# EAGLE board Spring2020V1.3 (EAGLE 9.5.2)
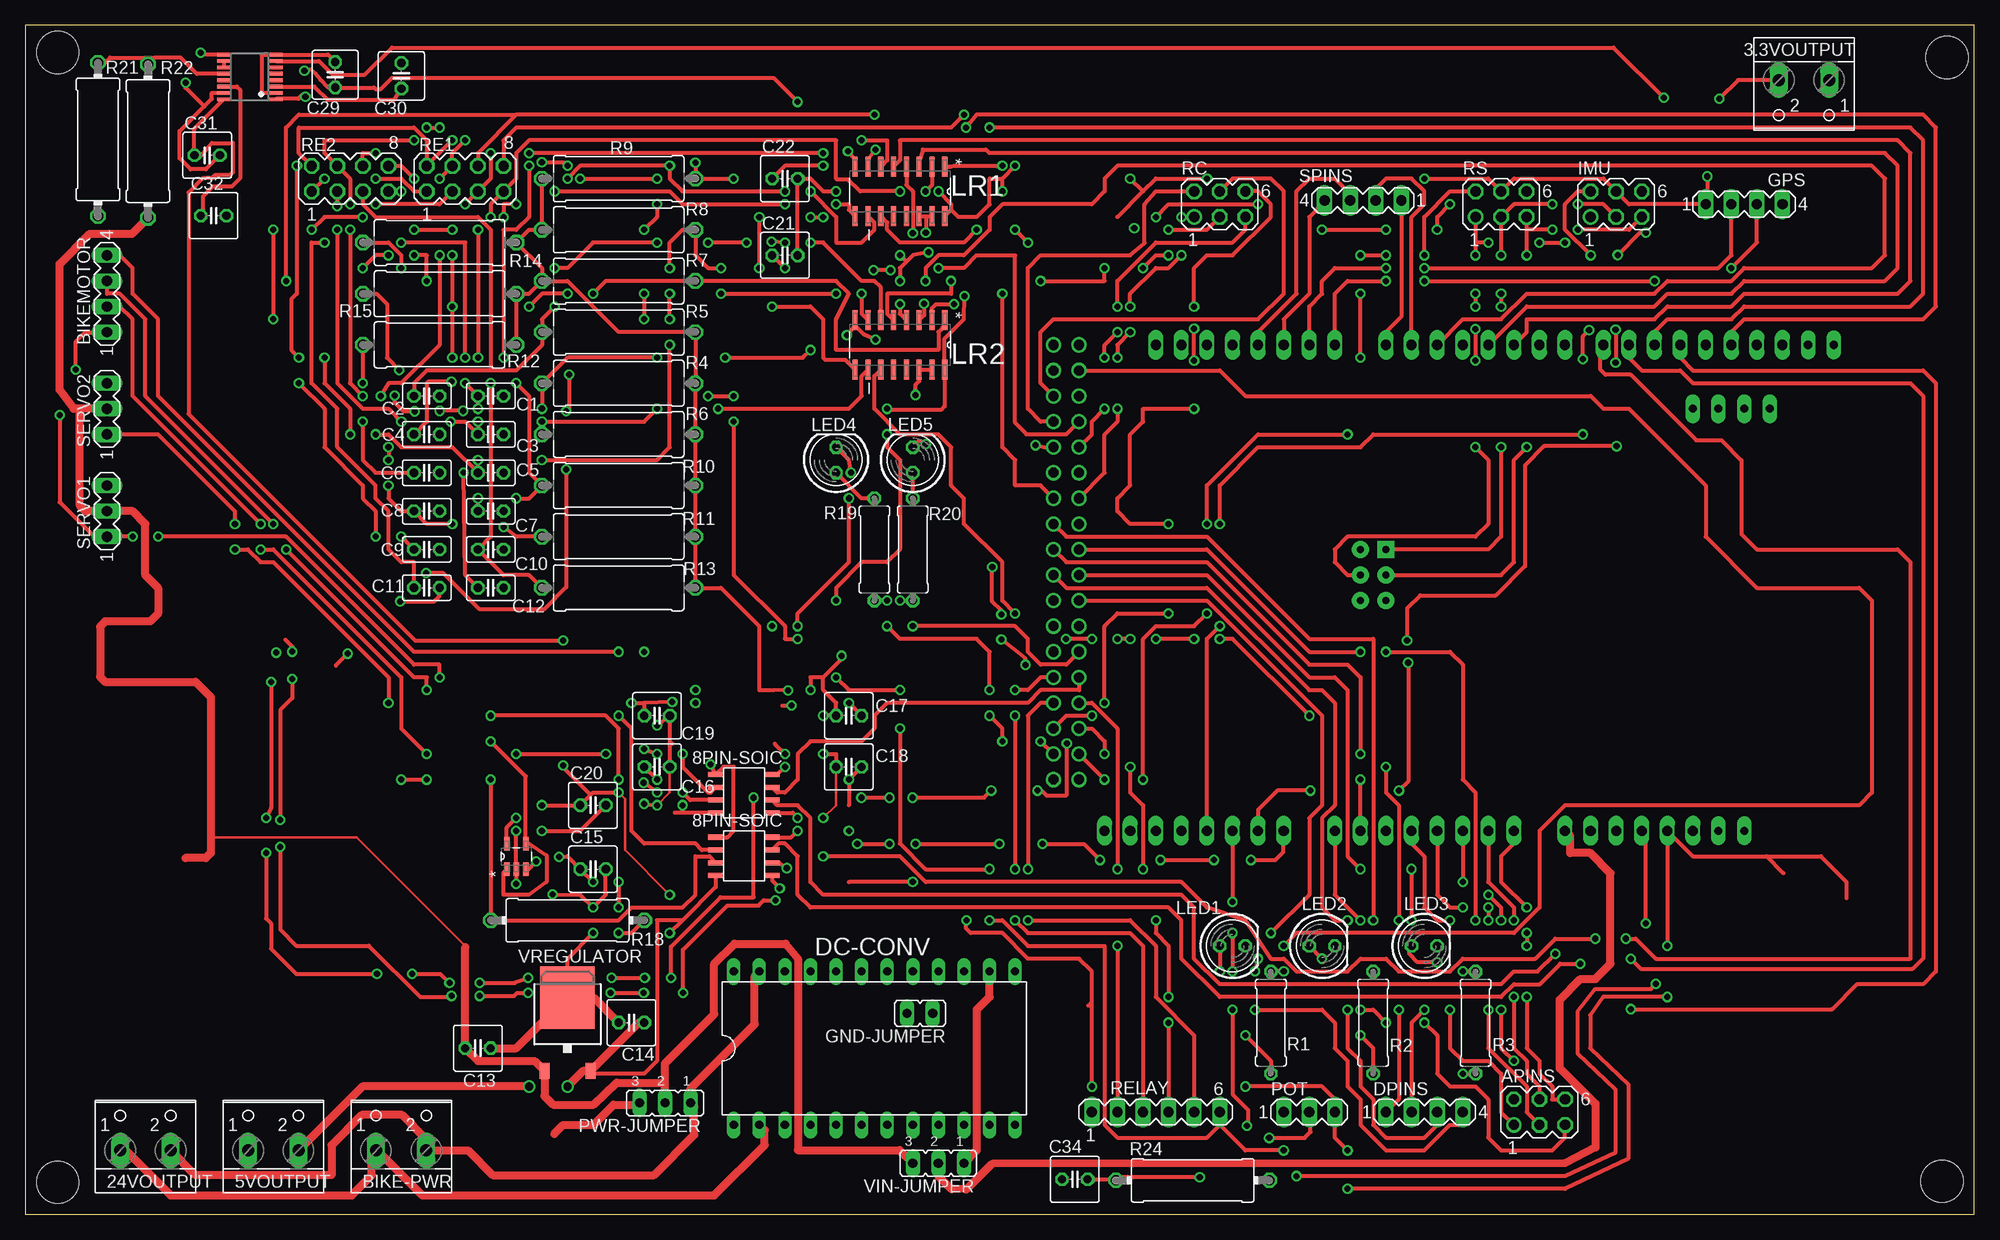
[diagram p2: board, top side]
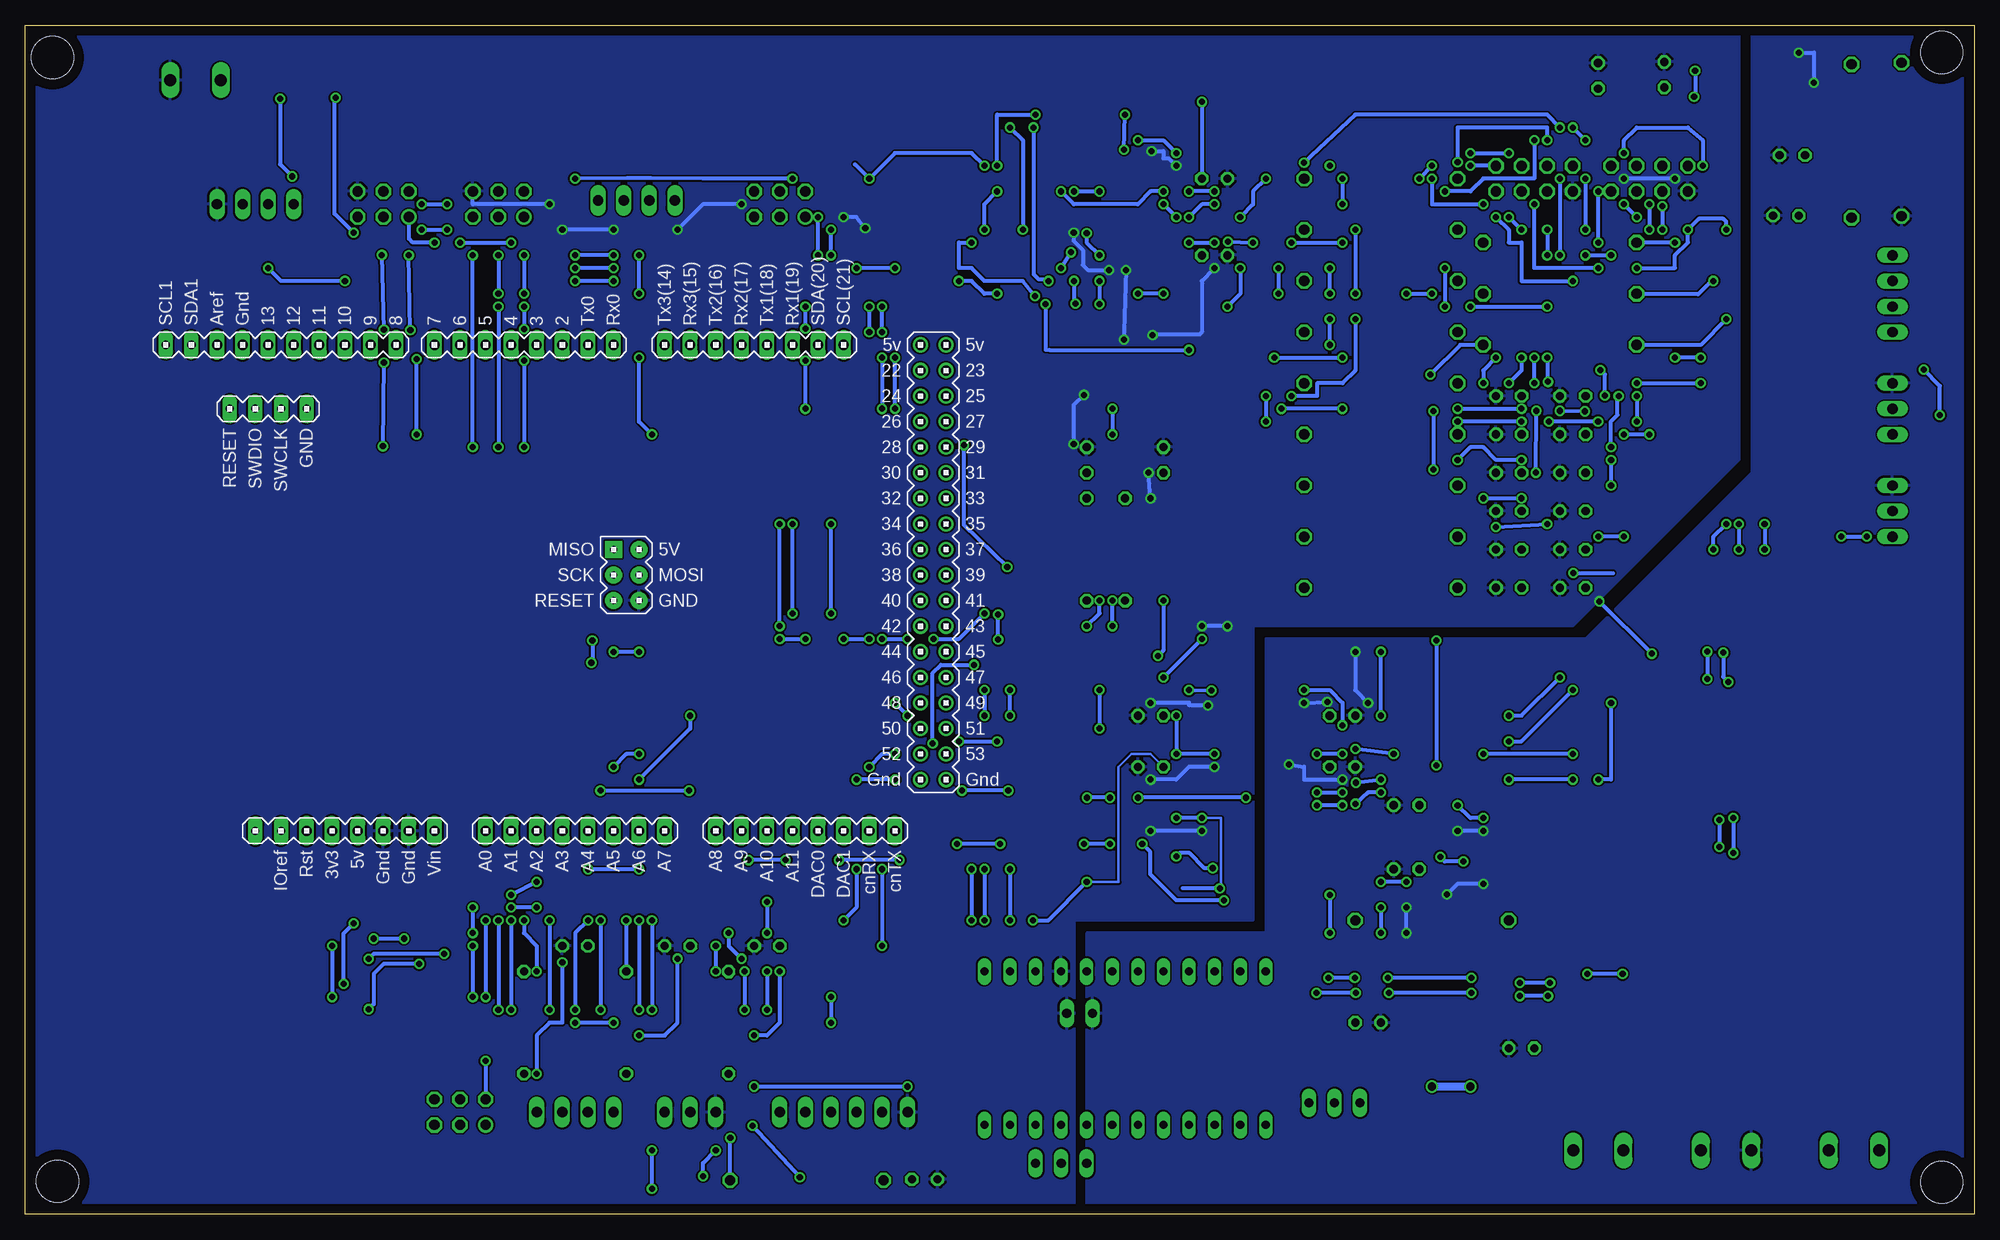
[diagram p3: board, bottom side, seen from below]

Size 193.55 x 118.11 mm. Coordinates in mm from the lower left corner, seen from the top.
Outline: 0,0 193.55,0 193.55,118.11 0,118.11 0,0
Copper layers (1*16): Top 0.035mm / dielectric 1.5mm / Bottom 0.035mm
Design rules "default *": minimum track width 10mil, minimum drill 0.6mm, track to track 7mil, track to pad 7mil, pad to pad 7mil, via to via 7mil, smd to smd 7mil, copper to edge 40mil, drill to drill 7mil, minimum pad ring 10mil, minimum via ring 8mil, stop-mask expansion 4mil, vias tented up to drill 0mil, thermal gap 10mil
Holes 4.2 mm at 3.23,3.19 3.23,115.39 190.83,114.89 190.33,3.29

## Footprints (pad centres in the part's own frame; a part is rotated, then mirrored left to right if it is on the bottom)
W237-102 = drill 1.194 long: 1 -2.5,-1.27; 2 2.5,-1.27
MA03-2 = drill 1.016: 1 -2.54,-1.27 | drill 1.016 octagon: 2 -2.54,1.27; 3 0,-1.27; 4 0,1.27; 5 2.54,-1.27; 6 2.54,1.27
MA04-1 = drill 1.016 long: 1 -3.81,0; 2 -1.27,0; 3 1.27,0; 4 3.81,0
C025-025X050 = drill 0.813 octagon: 1 -1.27,0; 2 1.27,0
C025-050X050 = drill 0.813 octagon: 1 -1.27,0; 2 1.27,0
DIL24-6 = drill 0.813 long: 1 -13.97,-7.62; 2 -11.43,-7.62; 3 -8.89,-7.62; 4 -6.35,-7.62; 5 -3.81,-7.62; 6 -1.27,-7.62; 7 1.27,-7.62; 8 3.81,-7.62; 9 6.35,-7.62; 10 8.89,-7.62; 11 11.43,-7.62; 12 13.97,-7.62; 13 13.97,7.62; 14 11.43,7.62; 15 8.89,7.62; 16 6.35,7.62; 17 3.81,7.62; 18 1.27,7.62; 19 -1.27,7.62; 20 -3.81,7.62; 21 -6.35,7.62; 22 -8.89,7.62; 23 -11.43,7.62; 24 -13.97,7.62
JP1 = drill 0.914 long: 1 0,-1.27; 2 0,1.27
LED5MM = drill 0.813 octagon: A -1.27,0; K 1.27,0
SOIC127P600X175-16N = smd 1.981 x 0.508: 1 -2.464,4.445; 2 -2.464,3.175; 3 -2.464,1.905; 4 -2.464,0.635; 5 -2.464,-0.635; 6 -2.464,-1.905; 7 -2.464,-3.175; 8 -2.464,-4.445; 9 2.464,-4.445; 10 2.464,-3.175; 11 2.464,-1.905; 12 2.464,-0.635; 13 2.464,0.635; 14 2.464,1.905; 15 2.464,3.175; 16 2.464,4.445
SOT95P280X145-5N = smd 1.321 x 0.559: 1 -1.27,0.94; 2 -1.27,0; 3 -1.27,-0.94; 4 1.27,-0.94; 5 1.27,0.94
MA03-1 = drill 1.016 long: 1 -2.54,0; 2 0,0; 3 2.54,0
JP2 = drill 0.914 long: 1 -2.54,0; 2 0,0; 3 2.54,0
0309/10 = drill 0.813 octagon: 1 -5.08,0; 2 5.08,0
P0613/15 = drill 1.016 octagon: 1 -7.62,0; 2 7.62,0
0414/15 = drill 1.016 octagon: 1 -7.62,0; 2 7.62,0
MA04-2 = drill 1.016 octagon: 1 -3.81,-1.27; 2 -3.81,1.27; 3 -1.27,-1.27; 4 -1.27,1.27; 5 1.27,-1.27; 6 1.27,1.27; 7 3.81,-1.27; 8 3.81,1.27
MA06-1 = drill 1.016 long: 1 -6.35,0; 2 -3.81,0; 3 -1.27,0; 4 1.27,0; 5 3.81,0; 6 6.35,0
DUE(NORMAL) = drill 1 long: 2 -16.51,30.48; 3 -19.05,30.48; 3V3 -39.37,-17.78; 4 -21.59,30.48; 5 -24.13,30.48; 5V -36.83,-17.78; 6 -26.67,30.48; 7 -29.21,30.48; 8 -33.02,30.48; 9 -35.56,30.48; 10 -38.1,30.48; 11 -40.64,30.48; 12 -43.18,30.48; 13 -45.72,30.48; A0 -24.13,-17.78; A1 -21.59,-17.78; A2 -19.05,-17.78; A3 -16.51,-17.78; A4 -13.97,-17.78; A5 -11.43,-17.78; A6 -8.89,-17.78; A7 -6.35,-17.78; A8 -1.27,-17.78; A9 1.27,-17.78; A10 3.81,-17.78; A11 6.35,-17.78; AREF -50.8,30.48; AREF1 -50.8,30.48; CANRX 13.97,-17.78; CANTX 16.51,-17.78; DAC0 8.89,-17.78; DAC1 11.43,-17.78; GND1 -48.26,30.48; GND_1 -34.29,-17.78; GND_2 -31.75,-17.78; RESET -41.91,-17.78; RX0 -11.43,30.48; RX1 6.35,30.48; RX2 1.27,30.48; RX3 -3.81,30.48; SCL 11.43,30.48; SDA 8.89,30.48; TX0 -13.97,30.48; TX1 3.81,30.48; TX2 -1.27,30.48; TX3 -6.35,30.48; VIN -29.21,-17.78 | drill 1: 5V_A 19.05,30.48; 5V_B 21.59,30.48; 22 19.05,27.94; 23 21.59,27.94; 24 19.05,25.4; 25 21.59,25.4; 26 19.05,22.86; 27 21.59,22.86; 28 19.05,20.32; 29 21.59,20.32; 30 19.05,17.78; 31 21.59,17.78; 32 19.05,15.24; 33 21.59,15.24; 34 19.05,12.7; 35 21.59,12.7; 36 19.05,10.16; 37 21.59,10.16; 38 19.05,7.62; 39 21.59,7.62; 40 19.05,5.08; 41 21.59,5.08; 42 19.05,2.54; 43 21.59,2.54; 44 19.05,0; 45 21.59,0; 46 19.05,-2.54; 47 21.59,-2.54; 48 19.05,-5.08; 49 21.59,-5.08; 50 19.05,-7.62; 51 21.59,-7.62; 52 19.05,-10.16; 53 21.59,-10.16; GND_A 19.05,-12.7; GND_B 21.59,-12.7 | drill 0.7 pad 1.676: 5V_ICSP -8.89,5.08; GND_ICSP -8.89,10.16; MOSI_ICSP -8.89,7.62; RESET_ICSP -11.43,5.08; SCK_ICSP -11.43,7.62 | drill 0.8 pad 1.422 long: GND_DEBUG -41.91,24.13; IOREF -44.45,-17.78; NC -46.99,-17.78; RESET_DEBUG -49.53,24.13; SCL1 -55.88,30.48; SDA1 -53.34,30.48; SWCLK_DEBUG -44.45,24.13; SWDIO_DEBUG -46.99,24.13 | drill 0.7 pad 1.676 square: MISO_ICSP -11.43,10.16
8PINSOIC = smd 1.524 x 0.508: 1 -2.794,2.286; 2 -2.794,1.016; 3 -2.794,-0.254; 4 -2.794,-1.524; 5 2.794,-1.524; 6 2.794,-0.254; 7 2.794,1.016; 8 2.794,2.286
QSOP16 = smd 0.381 x 1.27: 1 -2.223,-2.6; 2 -1.587,-2.6; 3 -0.953,-2.6; 4 -0.318,-2.6; 5 0.318,-2.6; 6 0.953,-2.6; 7 1.587,-2.6; 8 2.223,-2.6; 9 2.223,2.6; 10 1.587,2.6; 11 0.953,2.6; 12 0.318,2.6; 13 -0.318,2.6; 14 -0.953,2.6; 15 -1.587,2.6; 16 -2.223,2.6
TO252 = smd 1 x 1.6: 1 -2.28,-4.8; 2 2.28,-4.8 | smd 5.4 x 6.2: 3 0,2.5

## Placement (x,y rotation side)
3.3VOUTPUT  [W237-102]  176.63,111.39 180 top
5VOUTPUT  [W237-102]  24.64,7.62 0 top
24VOUTPUT  [W237-102]  11.94,7.62 0 top
APINS  [MA03-2]  150.37,10.16 0 top
BIKE-PWR  [W237-102]  37.34,7.62 0 top
BIKEMOTOR  [MA04-1]  8.13,91.44 90 top
C1  [C025-025X050]  46.23,81.28 0 top
C2  [C025-025X050]  39.88,81.28 0 top
C3  [C025-025X050]  46.23,77.47 0 top
C4  [C025-025X050]  39.88,77.47 0 top
C5  [C025-025X050]  46.23,73.66 0 top
C6  [C025-025X050]  39.88,73.66 0 top
C7  [C025-025X050]  46.23,69.85 0 top
C8  [C025-025X050]  39.88,69.85 0 top
C9  [C025-025X050]  39.88,66.04 0 top
C10  [C025-025X050]  46.23,66.04 0 top
C11  [C025-025X050]  39.88,62.23 0 top
C12  [C025-025X050]  46.23,62.23 0 top
C13  [C025-050X050]  44.96,16.51 0 top
C14  [C025-050X050]  60.2,19.05 180 top
C15  [C025-050X050]  56.39,34.29 0 top
C16  [C025-050X050]  62.74,44.45 180 top
C17  [C025-050X050]  81.79,49.53 0 top
C18  [C025-050X050]  81.79,44.45 0 top
C19  [C025-050X050]  62.74,49.53 180 top
C20  [C025-050X050]  56.39,40.64 0 top
C21  [C025-050X050]  75.44,95.25 0 top
C22  [C025-050X050]  75.44,102.87 0 top
C29  [C025-050X050]  30.79,113.19 90 top
C30  [C025-050X050]  37.36,113.08 90 top
C31  [C025-050X050]  18.08,105.19 0 top
C32  [C025-050X050]  18.71,99.19 0 top
C34  [C025-050X050]  104.23,3.49 180 top
DC-CONV  [DIL24-6]  84.33,16.51 0 top
DPINS  [MA04-1]  138.94,10.16 0 top
GND-JUMPER  [JP1]  88.85,19.97 90 top
GPS  [MA04-1]  170.69,100.33 0 top
IMU  [MA03-2]  157.99,100.33 0 top
LED1  [LED5MM]  119.89,26.67 0 top
LED2  [LED5MM]  128.78,26.67 0 top
LED3  [LED5MM]  138.94,26.67 0 top
LED4  [LED5MM]  80.52,74.93 90 top
LED5  [LED5MM]  88.14,74.93 90 top
LR1  ST26C32ABDR  [SOIC127P600X175-16N]  86.87,101.6 270 top
LR2  ST26C32ABDR  [SOIC127P600X175-16N]  86.87,86.36 270 top
OP-AMP  OPAMP  [SOT95P280X145-5N]  48.77,35.56 90 top
POT  [MA03-1]  127.51,10.16 0 top
PWR-JUMPER  [JP2]  63.54,11.08 180 top
R1  [0309/10]  123.7,19.05 270 top
R2  [0309/10]  133.86,19.05 270 top
R3  [0309/10]  144.02,19.05 270 top
R4  [P0613/15]  58.93,82.55 0 top
R5  [P0613/15]  58.93,87.63 0 top
R6  [P0613/15]  58.93,77.47 0 top
R7  [P0613/15]  58.93,92.71 0 top
R8  [P0613/15]  58.93,97.79 0 top
R9  [P0613/15]  58.93,102.87 0 top
R10  [P0613/15]  58.93,72.39 180 top
R11  [P0613/15]  58.93,67.31 180 top
R12  [P0613/15]  41.15,86.36 180 top
R13  [P0613/15]  58.93,62.23 180 top
R14  [P0613/15]  41.15,96.52 180 top
R15  [P0613/15]  41.15,91.44 180 top
R18  [0414/15]  53.85,29.21 0 top
R19  [0309/10]  84.33,66.04 90 top
R20  [0309/10]  88.14,66.04 90 top
R21  [0414/15]  7.23,106.76 90 top
R22  [0414/15]  12.2,106.6 270 top
R24  [0414/15]  115.93,3.39 180 top
RC  [MA03-2]  118.62,100.33 0 top
RE1  [MA04-2]  43.69,102.87 0 top
RE2  [MA04-2]  32.26,102.87 0 top
RELAY  [MA06-1]  112.27,10.16 0 top
RS  [MA03-2]  146.56,100.33 0 top
SERVO1  [MA03-1]  8.13,69.85 90 top
SERVO2  [MA03-1]  8.13,80.01 90 top
SPINS  [MA04-1]  132.84,100.71 180 top
U$1  DUE(NORMAL)  [DUE(NORMAL)]  123.7,55.88 0 bottom
U$2  IL-711  [8PINSOIC]  71.37,42.16 180 top
U$5  ISOLATED_ERROR_AMP_ADUM3190  [QSOP16]  22.32,112.96 90 top
U$7  IL-712  [8PINSOIC]  71.37,35.94 180 top
VIN-JUMPER  [JP2]  90.68,5.08 180 top
VREGULATOR  7818DT  [TO252]  53.85,19.05 0 top

## Tracks (layer width: path | path; a pad name or v marks a point on that pad's centre or on a via)
1AIN1  (via drill 0.6)
  Top 0.406: LR1.1 91.87,104.06 92.25,104.14 v97.03,104.14 | v93.22,109.22 91.95,107.95 48.77,107.95 47.5,106.68 RE1.8 | v50.04,104.14 50.04,99.06 48.77,97.79 47.5,97.79 v47.5,85.09 | v48.77,82.55 50.04,81.28 50.04,73.66 R10.2 50.04,71.12 v48.77,71.12 | C7.1 v44.96,71.12
  Bottom 0.406: v97.03,104.14 97.03,109.22 v93.22,109.22 | RE1.8 v50.04,104.14 | v47.5,85.09 48.77,83.82 v48.77,82.55 | v44.96,71.12 v48.77,71.12
1AIN2  (via drill 0.6)
  Top 0.406: LR1.2 90.04,102.23 v89.41,101.6 | v86.87,101.6 82.92,101.6 81.73,102.79 80.6,102.79 80.52,102.87 80.52,106.68 50.04,106.68 48.77,105.41 48.77,102.87 RE1.7 46.23,100.33 v46.23,99.06 | v44.96,97.79 v44.96,85.09 | v46.23,82.55 46.23,67.31 C10.1 47.5,63.5 50.04,63.5 R13.2
  Bottom 0.406: v89.41,101.6 v86.87,101.6 | v46.23,99.06 v44.96,97.79 | v44.96,85.09 44.96,83.82 v46.23,82.55
1AOUT
  Top 0.406: U$1.4 149.1,90.17 161.8,90.17 163.07,91.44 169.42,91.44 170.69,92.71 184.66,92.71 185.93,93.98 185.93,104.14 184.66,105.41 95.76,105.41 95.41,105.76 89.14,105.76 88.79,104.7 LR1.3
1BIN1  (via drill 0.6)
  Top 0.406: LR1.7 83.69,104.78 v84.43,105.76 | v84.33,109.22 48.77,109.22 | 48.77,109.22 44.96,105.41 RE1.6 | v25.91,92.71 25.91,107.95 27.18,109.22 48.77,109.22 | C12.1 43.69,63.5 v43.54,73.66 | v43.49,79.81 v41.15,79.81 | v36.69,81.33 36.69,80.63 37.53,79.79 38.63,79.79 v38.66,79.76 | R15.2 34.88,91.44 35.93,90.39 35.93,85.08 v37.14,83.87
  Bottom 0.406: v84.43,105.76 v84.33,109.22 | v43.54,73.66 v43.49,79.81 | v41.15,79.81 v38.66,79.76 | v25.91,92.71 26.11,92.71 27.43,91.39 33.48,91.39 R15.2 | v36.69,81.33 36.69,83.42 v37.14,83.87
1BIN2  (via drill 0.6)
  Top 0.406: v79.25,105.41 v50.04,105.41 | v46.23,105.41 46.23,102.87 RE1.5 v43.69,100.33 | v83.06,106.68 85.6,106.68 85.6,104.7 LR1.6 | C11.1 38.61,64.77 37.34,64.77 36.07,66.04 36.07,69.85 34.8,71.12 34.8,72.39 30.99,76.2 30.99,80.01 28.45,82.55 28.45,96.52 v29.72,96.52 | R14.2 36.07,96.52 37.34,95.25 v37.34,93.98
  Bottom 0.406: v83.06,106.68 80.52,106.68 v79.25,105.41 | v50.04,105.41 v46.23,105.41 | v29.72,96.52 R14.2 | v37.34,93.98 43.69,93.98 v43.69,100.33
1BOUT
  Top 0.406: U$1.5 149.1,87.63 149.1,88.9 161.8,88.9 163.07,90.17 169.42,90.17 170.69,91.44 185.93,91.44 187.2,92.71 187.2,105.41 185.93,106.68 86.87,106.68 86.87,104.7 LR1.5
1CIN1  (via drill 0.6)
  Top 0.406: v41.15,102.87 RE1.4 42.42,105.41 v43.69,106.68 | v41.15,95.25 41.15,86.36 37.34,82.55 36.07,82.55 v35.32,81.28 | v36.07,76.2 v36.07,74.93 | v36.07,72.39 36.07,71.12 37.34,69.85 C8.1 39.88,68.58 v42.42,68.58 | v52.58,101.6 64.01,101.6 65.28,100.33 v75.44,100.33 | v77.98,99.06 v79.25,99.06 | v80.52,100.33 81.79,100.33 81.79,99.77 LR1.9 | R11.2 48.77,67.31 v47.5,68.28
  Bottom 0.406: v41.15,102.87 v41.15,95.25 | v36.07,74.93 v36.07,72.39 | v43.69,106.68 43.69,102.87 48.77,102.87 50.04,101.6 v52.58,101.6 | v75.44,100.33 76.71,100.33 v77.98,99.06 | v79.25,99.06 v80.52,100.33 | v47.5,68.28 v42.42,68.58 | v36.07,76.2 36.07,78.75 35.43,79.39 35.43,81.17 v35.32,81.28
1CIN2  (via drill 0.6)
  Top 0.406: RE1.3 41.15,100.33 v34.8,100.33 | v33.53,99.06 29.72,99.06 v28.45,97.79 | v24.64,97.79 v24.64,88.9 | v75.44,101.6 65.28,101.6 64.01,102.87 v64.01,104.14 55.12,104.14 v53.85,102.87 | v77.98,101.6 80.52,99.06 80.52,96.52 83.06,96.52 84.33,97.79 84.33,98.5 LR1.10 | v48.77,100.33 47.5,100.33 v47.5,99.06 | v39.88,92.71 39.88,95.25 v38.61,95.25 | v36.07,95.25 34.8,95.25 v33.53,93.98 | R12.2 v33.53,82.55 | v27.18,82.55 29.72,80.01 29.72,76.2 33.53,72.39 33.53,71.12 34.8,69.85 v34.8,67.31 | v37.34,67.31 C9.1
  Bottom 0.406: v34.8,100.33 v33.53,99.06 | v24.64,88.9 27.18,86.36 R12.2 | v75.44,101.6 v77.98,101.6 | v53.85,102.87 53.85,100.33 v48.77,100.33 | v47.5,99.06 46.23,97.79 46.23,96.52 44.96,96.52 44.96,92.71 v39.88,92.71 | v38.61,95.25 v36.07,95.25 | v33.53,93.98 29.72,93.98 29.72,95.25 28.45,96.52 v28.45,97.79 27.35,98.89 24.93,98.89 24.64,98.6 v24.64,97.79 | v33.53,82.55 v27.18,82.55 | v34.8,67.31 v37.34,67.31
1COUT  (via drill 0.6)
  Top 0.406: U$1.10 161.8,87.63 163.07,88.9 169.42,88.9 170.69,90.17 187.2,90.17 188.47,91.44 188.47,106.68 187.2,107.95 v95.76,107.95 | v94.49,97.79 93.22,96.52 86.87,96.52 85.6,97.79 85.6,98.5 LR1.11
  Bottom 0.406: v95.76,107.95 94.49,106.68 v94.49,97.79
2AIN1  (via drill 0.6)
  Top 0.406: LR2.1 91.31,88.27 90.68,87.63 90.68,85.86 80.52,85.86 80.52,88.9 81.79,91.44 80.52,92.71 R7.2 57.66,92.71 v56.39,91.44 | v53.85,91.44 51.31,91.44 v50.04,90.17 | v42.42,85.09 v42.42,90.17 v42.42,95.25 | C4.1 39.88,78.74 39.88,82.55 40.02,82.69 v42.33,82.69 | RE2.8 37.34,104.14 v38.61,102.87 | v38.61,97.79 v42.42,97.79
  Bottom 0.406: v56.39,91.44 v53.85,91.44 | v50.04,90.17 v42.42,90.17 | v38.61,102.87 v38.61,97.79 | v42.42,97.79 v42.42,95.25 | v42.42,85.09 42.42,82.78 v42.33,82.69
2AIN2  (via drill 0.6)
  Top 0.406: v43.69,82.55 C1.1 v44.96,80.01 | v43.69,85.09 43.69,96.52 v37.34,96.52 | v37.34,101.6 RE2.7 | v62.74,85.09 53.85,85.09 R4.1 v51.31,80.01 | LR2.2 90.04,90 90.43,90.39 v92.23,90.39 | v69.52,85.09 77.21,85.09 v77.98,85.86
  Bottom 0.406: v43.69,82.55 v43.69,85.09 | v37.34,96.52 v37.34,101.6 | v77.98,85.86 91.85,85.86 92.23,85.88 v92.23,90.39 | v69.52,85.09 v62.74,85.09 | v51.31,80.01 v44.96,80.01
2AOUT  (via drill 0.6)
  Top 0.406: U$1.2 142.75,88.9 146.56,88.9 149.1,91.44 161.8,91.44 163.07,92.71 169.42,92.71 170.69,93.98 183.39,93.98 184.66,95.25 184.66,102.87 183.39,104.14 108.46,104.14 107.19,102.87 107.19,101.6 105.92,100.33 97.03,100.33 95.76,99.06 95.76,97.79 93.22,95.25 90.68,95.25 89.41,93.98 v89.41,92.71 | v89.26,90.47 89.26,89.31 LR2.3
  Bottom 0.406: v89.41,92.71 89.41,90.62 v89.26,90.47
2BIN1  (via drill 0.6)
  Top 0.406: RE2.6 33.53,105.41 v34.8,105.41 | v29.72,85.09 29.72,82.55 32.26,80.01 v32.26,77.47 | v34.8,77.47 36.07,77.47 37.34,76.2 42.42,76.2 C5.1 v44.96,74.93 | v51.31,74.93 62.74,74.93 64.01,76.2 v64.01,86.36 | v64.01,88.9 v64.01,91.44 | v64.01,93.98 64.01,96.52 65.28,97.79 R8.2 66.55,95.25 67.82,93.98 v69.09,93.98 | v69.09,91.44 v80.52,91.44 | v83.06,91.44 83.06,89.46 LR2.7 | v26.98,104.14 26.98,91.44 26.43,90.89 26.43,85.84 v27.18,85.09
  Bottom 0.406: v34.8,105.41 34.8,106.68 33.53,107.95 28.45,107.95 26.98,106.68 v26.98,104.14 | v27.18,85.09 v29.72,85.09 | v32.26,77.47 v34.8,77.47 | v44.96,74.93 47.5,74.93 48.77,76.2 50.04,76.2 v51.31,74.93 | v64.01,86.36 v64.01,88.9 | v64.01,91.44 v64.01,93.98 | v69.09,93.98 v69.09,91.44 | v80.52,91.44 v83.06,91.44
2BIN2  (via drill 0.6)
  Top 0.406: 46.23,83.82 48.77,83.82 51.31,86.36 R5.1 51.31,88.9 v52.58,90.17 | 46.23,83.82 39.88,83.82 38.61,82.55 C2.1 | RE2.5 33.53,100.33 34.8,99.06 44.96,99.06 46.23,97.79 46.23,83.82 | LR2.6 84.96,92.08 84.33,92.71 83.06,92.71 79.25,96.52 v77.98,96.52 | v75.44,96.52 v74.12,96.62 | v71.63,96.52 v67.82,96.52 | v62.74,96.52 56.39,96.52 53.85,93.98 v52.58,93.98
  Bottom 0.406: v77.98,96.52 v75.44,96.52 | v74.12,96.62 v71.63,96.52 | v67.82,96.52 v62.74,96.52 | v52.58,93.98 v52.58,90.17
2BOUT  (via drill 0.6)
  Top 0.406: U$1.13 169.42,87.63 170.69,88.9 188.47,88.9 189.74,90.17 189.74,107.95 188.47,109.22 94.49,109.22 v93.42,107.95 | v91.92,92.71 91.95,91.44 85.6,91.44 85.6,89.46 LR2.5
  Bottom 0.406: v93.42,107.95 93.42,93.38 92.93,92.89 92.1,92.89 v91.92,92.71
2CIN1  (via drill 0.6)
  Top 0.406: v38.61,106.68 29.72,106.68 29.72,105.41 RE2.4 32.26,102.87 v32.26,100.33 | v32.26,97.79 32.26,82.55 v33.53,81.28 | v33.53,78.74 33.53,74.93 34.8,73.66 C6.1 | v39.88,107.95 v41.15,107.95 | v66.55,104.44 R9.2 v70.36,102.87 | v72.9,99.06 v72.9,93.98 | v74.17,90.17 77.98,90.17 79.25,88.9 79.25,85.07 79.43,84.89 81.43,84.89 LR2.9
  Bottom 0.406: v38.61,106.68 v39.88,107.95 | v32.26,100.33 v32.26,97.79 | v33.53,81.28 v33.53,78.74 | v41.15,107.95 42.42,109.22 61.47,109.22 v66.55,104.44 | v70.36,102.87 71.63,101.6 71.63,100.33 v72.9,99.06 | v72.9,93.98 72.9,91.44 v74.17,90.17
2CIN2  (via drill 0.6)
  Top 0.406: RE2.3 v30.99,100.13 | v30.99,97.79 30.99,82.55 33.53,80.01 36.07,80.01 37.34,78.74 v37.36,78.74 | v42.25,78.74 43.69,78.74 C3.1 v44.96,78.74 | R6.1 v51.31,78.74 61.47,78.74 v62.74,80.01 | v68.82,80.01 81.79,80.01 83.06,81.28 83.06,83.26 LR2.10
  Bottom 0.406: v30.99,100.13 v30.99,97.79 | v37.36,78.74 v42.25,78.74 | v62.74,80.01 v68.82,80.01 | v44.96,78.74 v51.31,78.74
2COUT  (via drill 0.6)
  Top 0.406: U$1.A6 v132.59,43.18 | v127.51,49.53 119.89,57.15 v118.62,57.15 | v116.08,57.15 v112.27,57.15 | v109.73,57.15 v108.46,57.15 | v105.92,57.15 v103.36,57.15 | v98.3,59.69 97.03,60.96 97.03,64.77 93.22,68.58 93.22,71.12 91.95,72.39 91.95,76.2 90.68,77.47 86.87,77.47 84.33,80.01 84.33,83.26 LR2.11
  Bottom 0.406: v118.62,57.15 v116.08,57.15 | v112.27,57.15 v109.73,57.15 | v108.46,57.15 v105.92,57.15 | v103.36,57.15 100.84,57.15 v98.3,59.69 | v127.51,49.53 127.51,48.26 v132.59,43.18
3.3V  (via drill 0.6)
  Top 0.254: v79.25,39.37 80.52,40.64 C18.1 | 74.3,52.07 74.04,52.07
  Top 0.406: 172.93,35.56 165.61,35.56 U$1.3V3 v163.07,26.67 | 172.93,35.56 178.31,35.56 180.85,33.02 180.85,31.43 | v163.07,21.59 156.68,21.59 155.41,19.82 155.41,16.51 159.17,12.9 159.17,5.55 152.91,2.54 v131.32,2.54 | v131.32,6.35 130.05,7.62 POT.3 130.05,11.43 128.78,12.7 v121.16,12.7 | 108.46,99.06 111,101.6 | 111,101.6 112.27,102.87 v117.37,102.87 | v138.94,102.87 145.29,102.87 RS.4 147.83,102.87 156.72,102.87 IMU.4 159.26,100.33 GPS.1 167.03,100.48 v167.03,103.09 | v85.6,77.47 85.6,76.2 86.87,74.93 86.87,66.04 85.6,64.77 83.06,64.77 80.52,62.23 v80.52,60.96 | v77.98,52.07 77.98,53.34 79.25,53.34 | v75.74,52.02 74.3,52.07 | 79.25,53.34 79.25,52.07 80.52,50.8 C17.1 v79.25,49.53 | v79.25,45.72 80.52,45.72 C18.1 | U$2.1 76.2,39.88 v76.71,39.37 | C21.2 C22.2 77.98,102.87 79.25,101.6 v80.52,101.6 | v90.68,101.6 91.95,100.33 91.95,99.77 | 91.95,99.77 LR1.16 | 97.03,102.87 95.76,102.87 95.76,100.33 94.49,99.06 92.66,99.06 91.95,99.77 | 97.03,102.87 v98.3,104.14 | v109.73,102.87 111,101.6 | v93.27,91.19 93.22,88.9 91.31,87 LR2.16 91.31,80.28 90.93,79.89 85.72,79.89 v85.6,80.01 | v99.57,96.52 v98.3,97.79 | v97.03,101.6 97.03,102.87 | 74.42,46.74 v75.44,45.72 | v105.92,12.7 105.92,21.09 | 105.92,21.09 105.92,24.13 104.65,25.4 99.57,25.4 97.03,27.94 93.88,27.94 93.43,28.39 93.43,29.15 v93.49,29.21 | v88.14,33.02 81.79,33.02 | R7.1 50.04,91.44 R15.1 R12.1 | R7.1 51.31,93.98 R14.1 50.04,97.79 R8.1 R9.1 | R7.1 53.85,92.71 58.93,87.63 R5.2 R4.2 R6.2 R10.1 R11.1 R13.1 69.09,62.23 72.9,58.42 72.9,52.07 74.04,52.07 | v27.73,113.59 27.83,113.69 28.33,113.69 28.83,113.29 29.33,112.69 30.1,111.92 C29.1 34.64,111.92 34.8,111.76 35.3,111.76 36.43,112.89 74.31,112.89 v76.71,110.49
  Top 0.406: v27.83,110.99 27.53,111.19 27.13,110.79 24.97,110.79 U$5.1 | 105.57,20.74 105.92,21.09 | 3.3VOUTPUT.2 170.1,112.66 v168.23,110.79 | v54.03,83.39 54.03,80.09 v53.73,79.79 | v53.73,73.99 53.73,62.29 51.53,60.09 45.13,60.09 41.53,63.69 v39.83,63.69 | U$7.1 74.17,33.15 v74.93,32.39 | v81.07,55.48 81.07,55.16 79.25,53.34 | 174.6,33.89 172.93,35.56
  Bottom 0.254: v76.71,39.37 74.8,39.37 74.8,32.39 v74.93,32.39 | C18.1 81.79,45.72 83.69,45.72 84.96,44.45 84.96,33.02 v88.14,33.02
  Bottom 0.406: v163.07,26.67 v163.07,21.59 | v131.32,2.54 v131.32,6.35 | v117.37,102.87 126.24,102.87 131.42,102.92 133.76,102.92 v138.94,102.87 | v85.6,80.01 v85.6,77.47 | v77.98,52.07 v75.74,52.02 | v79.25,49.53 v79.25,45.72 v75.44,45.72 | v76.71,39.37 v79.25,39.37 | v80.52,101.6 81.79,101.6 83.06,100.33 89.41,100.33 v90.68,101.6 | v98.3,104.14 99.57,105.41 107.19,105.41 v109.73,102.87 111.16,104.3 | v93.27,91.19 94.49,92.71 98.3,92.71 99.57,93.98 100.84,93.98 100.84,96.52 v99.57,96.52 | v98.3,97.79 98.3,100.33 v97.03,101.6 | v121.16,12.7 v105.92,12.7 | v93.49,29.21 91.95,29.21 v88.14,33.02 | v27.73,113.59 27.73,111.29 v27.83,110.99 | v76.71,110.49 C22.2 | v168.23,110.79 168.23,104.29 v167.03,103.09 | R12.1 51.06,86.36 v54.03,83.39 | v53.73,79.79 v53.73,73.99 | v39.83,63.69 35.89,63.69 | v74.93,32.39 78.62,32.39 | v80.52,60.96 80.52,56.03 v81.07,55.48
5V  (via drill 0.6)
  Top 0.406: v126.24,3.81 152.91,3.81 157.9,6.1 157.9,12.45 154.14,16.01 154.14,20.1 155.93,22.39 161.43,22.39 v161.93,22.89 | v124.97,6.35 121.16,6.35 118.62,8.89 | 118.62,8.89 RELAY.6 | v76.71,57.15 75.44,57.15 75.44,58.42 70.36,63.5 v70.36,78.74 | v80.52,53.34 81.79,52.07 v86.87,52.07 | v86.87,48.26 86.87,36.83 89.41,34.29 v95.76,34.29 | v95.76,29.21 97.03,29.21 99.57,26.67 107.19,26.67 107.19,8.89 108.46,7.62 117.35,7.62 118.62,8.89 | RE2.2 27.18,105.41 27.18,107.95 38.61,107.95 39.88,106.68 RE1.2 v42.42,106.68 | v55.12,102.87 v62.74,102.87 | v62.74,100.33 62.74,99.06 v61.47,97.79 | v61.47,91.44 v61.47,88.9 | v67.82,81.28 v70.36,81.28 | v51.31,104.49 53.5,104.49 v53.85,104.14 | v160.93,28.89 160.93,37.7 U$1.5V
  Bottom 0.406: v126.24,3.81 126.24,5.08 v124.97,6.35 | v76.71,57.15 v80.52,53.34 | v86.87,52.07 v86.87,48.26 | v95.76,34.29 v95.76,29.21 | v42.42,106.68 42.42,107.95 51.31,107.95 v51.31,104.49 | v53.85,104.14 v55.12,102.87 | v62.74,102.87 v62.74,100.33 | v61.47,97.79 v61.47,91.44 | v61.47,88.9 61.47,83.82 62.74,82.55 65.28,82.55 65.28,81.28 v67.82,81.28 | v70.36,81.28 v70.36,78.74 | v161.93,22.89 161.93,27.89 v160.93,28.89
12V
  Top 0.813: VIN-JUMPER.1 94.49,6.35 94.49,20.32 95.76,21.59 DC-CONV.14
22  (via drill 0.6)
  Top 0.406: U$1.22 118.62,83.82 121.16,81.28 155.45,81.28 156.72,80.01 159.26,80.01 166.88,72.39 166.88,67.31 171.96,62.23 182.12,62.23 183.39,60.96 183.39,41.91 182.12,40.64 152.91,40.64 150.37,38.1 150.37,30.48 147.83,27.94 126.24,27.94 v124.97,26.67 | v124.97,24.13 R1.1
  Bottom 0.406: v124.97,26.67 v124.97,24.13
24GND
  Top 0.813: 24VOUTPUT.1 9.97,6.35 14.43,1.89 32.43,1.89 34.43,3.89 34.43,5.94 BIKE-PWR.1 34.97,6.35 39.43,1.89 68.43,1.89 73.43,6.89 73.43,8.36 DC-CONV.2
29  (via drill 0.6)
  Top 0.406: v45.13,22.99 48.63,22.99 48.73,23.09 v49.93,23.49 | v58.23,23.49 v61.53,23.49 | v64.13,23.49 64.13,26.59 69.03,31.49 72.33,31.49 v72.33,41.39 | v83.03,41.39 v85.83,41.39 | v88.13,41.39 95.23,41.39 v95.93,42.09 | v100.53,42.09 100.93,42.09 101.43,41.59 103.33,41.59 103.43,41.69 v103.43,46.79 | v99.33,54.59 99.33,55.19 v96.93,57.09 | v96.93,59.59 96.93,59.99 96.03,60.89 v96.03,64.29 | v100.33,76.39 101.2,76.19 U$1.29 | v24.92,55.79 v24.93,55.79 | v24.43,52.89 24.43,40.39 v23.93,39.39 | v23.93,35.89 23.93,29.39 24.43,28.89 24.43,26.39 26.93,23.89 v34.93,23.89 | v38.43,23.89 41.23,23.89 v42.13,22.99
  Bottom 0.406: v42.13,22.99 v45.13,22.99 | v49.93,23.49 v58.23,23.49 | v72.33,41.39 v83.03,41.39 | v85.83,41.39 v88.13,41.39 | v95.93,42.09 v100.53,42.09 | v103.43,46.79 103.43,53.79 102.63,54.59 v99.33,54.59 | v96.93,57.09 v96.93,59.59 | v96.03,64.29 100.33,68.49 v100.33,76.39 | v61.53,23.49 v64.13,23.49 | v24.93,55.79 24.93,53.39 v24.43,52.89 | v23.93,39.39 v23.93,35.89 | v34.93,23.89 v38.43,23.89
35  (via drill 0.6)
  Top 0.406: U$1.35 103.38,67.31 117.35,67.31 127.51,57.15 133.86,57.15 v133.86,29.21
  Bottom 0.406: v133.86,29.21 R2.1
36  (via drill 0.6)
  Top 0.406: U$1.36 117.35,66.04 127.51,55.88 v132.59,55.88 | v135.13,55.88 141.48,55.88 142.75,54.61 142.75,43.18 144.02,41.91 v144.02,29.21 | v142.75,24.13 R3.1
  Bottom 0.406: v132.59,55.88 v135.13,55.88 | v144.02,29.21 144.02,27.94 142.75,26.67 v142.75,24.13
37  (via drill 0.6)
  Top 0.406: U$1.37 103.38,64.77 117.35,64.77 127.51,54.61 131.32,54.61 132.59,53.34 v132.59,45.72 | v135.13,44.45 135.13,41.91 136.4,40.64 v136.4,29.21 | v136.4,20.32 136.4,11.43 DPINS.1
  Bottom 0.406: v132.59,45.72 133.86,45.72 v135.13,44.45 | v136.4,29.21 v136.4,20.32
38  (via drill 0.6)
  Top 0.406: U$1.38 117.35,63.5 127.51,53.34 130.05,53.34 131.32,52.07 131.32,35.56 v132.59,34.29 | v137.67,34.29 v137.67,29.21 | v138.94,20.32 137.67,19.05 DPINS.2
  Bottom 0.406: v132.59,34.29 v137.67,34.29 | v137.67,29.21 138.94,27.94 v138.94,20.32
39  (via drill 0.6)
  Top 0.406: U$1.39 103.38,62.23 117.35,62.23 127.51,52.07 128.78,52.07 130.05,50.8 130.05,40.64 128.78,39.37 128.78,30.48 130.05,29.21 v131.32,29.21 | v131.32,20.32 131.32,16.51 132.59,15.24 132.59,12.7 133.86,11.43 133.86,8.89 135.13,7.62 138.94,7.62 140.21,8.89 DPINS.3
  Bottom 0.406: v131.32,29.21 v131.32,20.32
40  (via drill 0.6)
  Top 0.406: U$1.40 117.35,60.96 128.78,49.53 128.78,40.64 127.51,39.37 127.51,31.75 v123.7,27.94 | v122.43,25.4 v122.13,24.13 | v122.13,20.32 128.78,20.32 130.05,19.05 130.05,16.51 131.32,15.24 131.32,12.7 132.59,11.43 132.59,8.89 135.13,6.35 138.94,6.35 141.48,8.89 142.75,8.89 DPINS.4
  Bottom 0.406: v123.7,27.94 123.7,26.67 v122.43,25.4 | v122.13,24.13 v122.13,20.32
44  (via drill 0.6)
  Top 0.406: U$1.44 103.38,54.61 100.84,54.61 99.57,55.88 99.57,57.15 98.3,58.42 v88.14,58.42 | v86.87,60.96 R20.1
  Bottom 0.406: v88.14,58.42 86.87,59.69 v86.87,60.96
47  (via drill 0.6)
  Top 0.406: U$1.47 100.84,53.34 99.57,52.07 v98.3,52.07 | v98.3,49.53 v98.3,34.29 | v98.3,29.21 99.57,27.94 109.73,27.94 111,26.67 RELAY.3
  Bottom 0.406: v98.3,52.07 v98.3,49.53 | v98.3,34.29 v98.3,29.21
48  (via drill 0.6)
  Top 0.406: U$1.48 105.92,50.8 108.46,48.26 v108.46,34.29 | v108.46,26.67 RELAY.2
  Bottom 0.406: v108.46,34.29 v108.46,26.67
49  (via drill 0.6)
  Top 0.406: U$1.49 100.84,50.8 99.57,49.53 v99.57,34.29 | v99.57,29.21 109.73,29.21 112.27,26.67 112.27,21.59 116.08,17.78 RELAY.5
  Bottom 0.406: v99.57,34.29 v99.57,29.21
50  (via drill 0.6)
  Top 0.406: U$1.50 105.92,48.26 107.19,46.99 v107.19,45.72 | v109.73,44.45 109.73,41.91 111,40.64 v111,34.29 | v112.27,29.21 112.27,27.94 113.54,26.67 v113.54,21.59 | v113.54,19.05 RELAY.4
  Bottom 0.406: v107.19,45.72 108.46,45.72 v109.73,44.45 | v111,34.29 111,30.48 v112.27,29.21 | v113.54,21.59 v113.54,19.05
53  (via drill 0.6)
  Top 0.406: U$1.53 v100.84,46.99 | v97.03,46.99 97.03,48.26 v95.76,49.53 | v95.76,52.07 95.76,55.88 94.49,57.15 86.87,57.15 v85.6,58.42 | v85.6,60.96 R19.1
  Bottom 0.406: v100.84,46.99 v97.03,46.99 | v95.76,49.53 v95.76,52.07 | v85.6,58.42 v85.6,60.96
A0  (via drill 0.6)
  Top 0.406: U$1.A0 147.83,36.83 146.56,35.56 146.56,33.02 v149.1,30.48 | v149.1,27.94 v149.1,26.67 | v149.1,21.59 149.1,16.51 150.37,15.24 150.37,13.97 151.64,12.7 151.64,11.43 APINS.6
  Bottom 0.406: v149.1,30.48 v149.1,27.94 | v149.1,26.67 v149.1,21.59
A1  (via drill 0.6)
  Top 0.406: U$1.A1 145.29,33.02 147.83,30.48 v147.83,29.21 | v147.83,21.59 147.83,16.51 149.1,15.24 149.1,13.97 150.37,12.7 APINS.4
  Bottom 0.406: v147.83,29.21 v147.83,21.59
A2  (via drill 0.6)
  Top 0.406: U$1.A2 v142.75,33.02 | v145.29,31.75 146.56,30.48 v146.56,29.21 | v146.56,20.32 146.56,16.51 v147.83,15.24
  Bottom 0.406: v142.75,33.02 v145.29,31.75 | v146.56,29.21 v146.56,20.32 | v147.83,15.24 APINS.2
A3  (via drill 0.6)
  Top 0.406: U$1.A3 140.21,31.75 141.48,30.48 v142.75,30.48 | v145.29,30.48 v145.29,29.21 | v145.29,20.32 145.29,16.51 149.1,12.7 149.1,10.16 APINS.3
  Bottom 0.406: v142.75,30.48 v145.29,30.48 | v145.29,29.21 v145.29,20.32
A4  (via drill 0.6)
  Top 0.406: U$1.A4 137.67,36.83 138.94,35.56 138.94,30.48 140.21,29.21 v141.48,29.21 | v141.48,20.32 141.48,16.51 142.75,15.24 145.29,15.24 146.56,13.97 146.56,10.16 APINS.1
  Bottom 0.406: v141.48,29.21 v141.48,20.32
A7  (via drill 0.6)
  Top 0.406: U$1.A7 130.05,31.75 v132.59,29.21 | v132.59,20.32 133.86,20.32 v135.13,19.05 | v138.94,19.05 140.21,17.78 140.21,13.97 141.48,12.7 144.02,12.7 145.29,11.43 145.29,7.62 146.56,6.35 151.64,6.35 152.91,7.62 APINS.5
  Bottom 0.406: v132.59,29.21 v132.59,20.32 | v135.13,19.05 v138.94,19.05
A10  (via drill 0.6)
  Top 0.406: U$1.A10 v119.89,31.03 | v119.89,27.94 v119.89,24.13 | v116.63,3.69 108.61,3.69 R24.2 108.31,3.49 C34.1 | v119.89,20.32 119.89,11.93 121.43,10.39 121.43,8.89 v121.33,8.79
  Bottom 0.406: v119.89,31.03 v119.89,27.94 | v119.89,24.13 v119.89,20.32 | v121.33,8.79 v116.63,3.69
A10R  (via drill 0.6)
  Top 0.406: v123.53,7.59 127.03,7.59 127.63,8.19 127.63,10.04 POT.2
  Bottom 0.406: R24.1 123.55,7.17 v123.53,7.59
BAT+
  Top 0.254: 43.69,26.54 43.69,26.67 32.89,37.47 18.43,37.47 18.29,37.47
  Top 0.813: 43.69,26.54 C13.1 44.96,15.24 50.58,15.24 VREGULATOR.1 51.57,11.75 52.43,10.89 56.43,10.89 58.73,13.09 63.44,13.09 63.54,13.19 | SERVO2.2 5.43,80.01 | 5.43,80.01 4.81,80.01 3.43,81.89 3.43,94.39 6.43,97.39 10.61,97.39 R22.2 | 15.9,35.39 17.93,35.39 18.43,35.89 18.43,37.47 18.43,51.39 16.93,52.89 7.93,52.89 7.43,53.39 7.43,58.39 7.93,58.89 12.43,58.89 13.21,59.67 13.21,62.23 11.94,63.5 11.94,68.58 10.67,69.85 SERVO1.2 5.97,69.85 5.43,70.39 5.43,80.01 | 63.43,11.89 63.43,11.19 PWR-JUMPER.2 63.54,13.19 | 63.54,13.19 63.54,15 68.43,19.89 68.43,24.89 70.43,26.89 75.53,26.89 76.73,25.39 76.73,6.39 86.83,6.39 VIN-JUMPER.3
BGND  (via drill 0.6)
  Top 0.406: VREGULATOR.3 53.85,25.4 v56.39,27.94 | C15.2 57.66,31.75 v56.39,30.48 55.12,31.75 v52.36,31.8 | v68.07,44.7 U$2.5 69.34,44.45 70.36,44.45 70.36,38.1 69.72,37.47 U$7.5 | v62.74,43.18 C16.2 | 66.8,50.55 v66.55,50.8 | v64.26,50.9 61.47,50.8 | 61.47,50.8 C19.2 | 61.59,56.01 v61.47,55.88 | v60.2,50.8 61.47,50.8 | v48.77,32.82 OP-AMP.2 v48.77,38.1 | v51.31,38.1 55.12,38.1 C20.2 | C31.2 19.33,105.19 17.93,103.79 16.43,103.79 15.33,104.89 15.33,107.59 17.78,110.04 | 17.78,110.04 18.53,110.79 18.53,111.39 19.7,111.39 U$5.15 | U$5.9 17.64,115.18 v17.43,115.39 | v15.93,112.39 15.93,111.89 17.78,110.04
  Top 0.813: C13.2 48.77,16.51 52.58,20.32 52.62,20.32 VREGULATOR.3 56.43,21.55 C14.2
  Bottom 0.406: v56.39,27.94 v56.39,30.48 | v68.07,44.7 66.55,44.45 66.55,43.18 v62.74,43.18 | v66.55,50.8 v64.26,50.9 | v61.47,55.88 61.47,52.07 v60.2,50.8 | v48.77,38.1 v51.31,38.1 | v17.43,115.39 15.93,115.39 v15.93,112.39 | v48.77,32.82 51.34,32.82 v52.36,31.8
  pour Bottom: 0.11,118.21 22.1,118.11 22.1,73.66 38.61,57.15 70.36,57.15 70.36,27.94 88.14,27.94 88.14,0 0.11,0.1
BIKE-IN
  Top 0.813: 24VOUTPUT.2 16.9,3.89 30.43,3.89 30.43,6.89 33.43,9.89 37.43,9.89 39.84,7.48 BIKE-PWR.2 43.97,6.35 46.43,3.89 62.43,3.89 66.43,7.89 66.43,10.73 PWR-JUMPER.1 66.08,12.54 72.43,18.89 72.43,23.66 DC-CONV.23
BRAKE  (via drill 0.6)
  Top 0.406: U$1.28 105.92,77.47 105.92,78.74 v107.19,80.01 | v107.19,85.09 107.19,86.36 v108.46,87.63 | v108.46,90.17 108.46,92.71 112.27,96.52 119.89,96.52 121.16,97.79 RC.5
  Bottom 0.406: v107.19,80.01 v107.19,85.09 | v108.46,87.63 v108.46,90.17
CH1  (via drill 0.6)
  Top 0.406: U$1.51 103.38,49.53 v105.92,49.53 | v107.19,50.8 107.19,58.42 108.46,59.69 v113.54,59.69 | v113.54,68.58 109.73,68.58 108.46,69.85 108.46,71.12 109.73,72.39 109.73,77.47 111,78.74 111,80.01 v116.08,80.01 | v116.08,84.79 v116.08,87.98 | v116.08,90.17 116.08,93.98 117.35,95.25 119.89,95.25 123.7,99.06 123.7,100.33 122.43,101.6 RC.6
  Bottom 0.406: v105.92,49.53 v107.19,50.8 | v113.54,59.69 v113.54,68.58 | v116.08,80.01 v116.08,84.79 | v116.08,87.98 v116.08,90.17
CH2
  Top 0.406: U$1.25 100.84,82.55 100.84,87.63 102.11,88.9 122.43,88.9 124.97,91.44 124.97,101.6 123.7,102.87 119.89,102.87 RC.4
CURRENT_SENSE  (via drill 0.6)
  Top 0.406: v45.13,21.69 48.53,21.69 48.83,21.99 v49.93,21.99 | v58.13,21.99 v61.43,21.99 | v65.33,21.99 65.33,26.29 69.73,30.69 72.83,30.69 73.33,31.19 v74.53,31.19 | v82.63,36.79 v85.83,36.79 | v88.43,36.79 v96.73,36.79 | v101.03,36.79 105.13,36.79 v106.73,35.19 | v112.73,35.19 v118.03,35.19 | v121.73,35.19 124.13,35.19 124.93,35.99 124.93,38.06 U$1.A8 | 25.86,57.05 26.53,56.39 v26.53,55.89 | v26.53,53.19 26.53,51.29 25.33,50.09 v25.33,39.19 | v25.33,36.49 25.33,28.29 26.93,26.69 34.13,26.69 39.23,21.59 42.23,21.59 v42.33,21.69
  Bottom 0.406: v42.33,21.69 v45.13,21.69 | v49.93,21.99 v58.13,21.99 | v61.43,21.99 v65.33,21.99 | v74.53,31.19 79.23,31.19 81.83,33.79 81.83,35.99 v82.63,36.79 | v85.83,36.79 v88.43,36.79 | v96.73,36.79 v101.03,36.79 | v106.73,35.19 v112.73,35.19 | v118.03,35.19 v121.73,35.19 | v26.53,55.89 v26.53,53.19 | v25.33,39.19 v25.33,36.49
EAOUT  (via drill 0.6)
  Top 0.406: U$5.7 29.17,114.55 30.53,113.19 33.73,113.19 36.43,115.89 157.73,115.89 v162.73,110.89 | v160.93,97.49 160.33,97.49 v158.13,95.29 | v157.93,87.89 v157.93,84.59 | v137.23,56.99 137.23,60.19 138.53,61.49 146.03,61.49 148.93,64.39 148.93,74.39 150.83,76.29 v158.03,76.29 | v137.33,54.79 137.33,42.99 v136.43,42.09 | v127.63,42.09 124.33,42.09 122.43,40.19 U$1.A9
  Bottom 0.406: v160.93,97.49 162.83,99.39 162.83,110.79 v162.73,110.89 | v158.13,95.29 v157.93,87.89 | v157.93,84.59 v158.03,76.29 | v137.23,56.99 137.23,54.89 v137.33,54.79 | v136.43,42.09 v127.63,42.09
FRONT-DIGI
  Top 0.406: U$1.46 104.65,52.07 100.84,52.07 99.57,50.8 85.6,50.8 84.33,49.53 84.33,48.26 83.06,46.99 77.98,46.99 76.71,45.72 76.71,43.18 75.44,41.91 74.68,41.91 U$2.3
FRONT-DIGIOUT  (via drill 0.6)
  Top 0.406: v23.37,66.04 24.64,66.04 37.34,53.34 37.34,48.26 v39.88,45.72 | v48.77,45.72 v57.66,45.72 | v61.47,46.22 v62.74,45.72 | v65.28,45.72 65.28,44.45 67.82,41.91 68.07,41.91 U$2.6 | v23.37,68.58 10.67,81.28 10.67,88.9 9.4,90.17 BIKEMOTOR.2
  Bottom 0.406: v23.37,68.58 v23.37,66.04 | v39.88,45.72 v48.77,45.72 | v57.66,45.72 v61.47,46.22 | v62.74,45.72 v65.28,45.72
FRONT-PWM  (via drill 0.6)
  Top 0.406: U$1.9 159.26,85.09 160.53,83.82 164.34,83.82 165.61,82.55 187.2,82.55 188.47,81.28 188.47,25.4 188.44,25.4 187.43,24.39 160.43,24.39 v159.43,25.39 | U$2.2 74.68,40.64 76.71,40.64 77.98,39.37 77.98,33.02 79.25,31.75 114.81,31.75 116.08,30.48 116.08,25.4 118.62,22.86 146.56,22.86 147.83,24.13 150.17,24.13 v151.93,25.89
  Bottom 0.406: v151.93,25.89 158.93,25.89 v159.43,25.39
FRONT-PWMOUT/SERVO1  (via drill 0.6)
  Top 0.406: U$2.7 66.04,41.15 v65.28,41.91 | v62.74,41.91 v61.42,42.88 | v58.93,43.18 58.93,48.26 57.66,49.53 v46.23,49.53 | v41.15,53.34 41.15,54.61 38.61,54.61 25.91,67.31 v13.21,67.31 | v10.67,67.31 SERVO1.1 6.86,67.31 3.43,70.74 v3.43,79.39 | v5.03,83.89 5.03,86.69 5.93,87.59 8.09,87.59 BIKEMOTOR.1
  Bottom 0.406: v65.28,41.91 v62.74,41.91 | v61.42,42.88 v58.93,43.18 | v46.23,49.53 44.96,49.53 v41.15,53.34 | v13.21,67.31 v10.67,67.31 | v3.43,79.39 3.43,82.29 v5.03,83.89
GND  (via drill 0.6)
  Top 0.406: LR1.8 82.42,104.78 v81.69,105.61 | v79.25,104.14 75.44,104.14 C22.1 | LR2.8 82.42,88.27 | 82.42,88.27 v81.59,87.33 | v75.44,93.98 C21.1 | v76.71,58.42 76.71,59.69 81.79,64.77 v81.79,71.12 | v81.99,73.66 81.79,74.93 LED4.K | 75.18,50.55 v76.09,50.55 | v81.79,50.8 C17.2 | U$2.4 74.68,43.69 v75.44,44.45 | C18.2 v81.79,43.18 81.79,40.64 | U$7.4 76.07,37.47 v76.71,38.1 | v112.27,99.06 113.54,100.33 v122.43,100.33 | v128.78,97.79 v135.13,97.79 | v140.21,97.79 140.21,99.06 v141.48,100.33 | RE2.1 v29.72,102.87 | v34.8,102.87 37.34,102.87 38.61,101.6 RE1.1 | C29.2 30.07,115.18 U$5.8 24.83,115.19 23.53,115.19 23.53,111.49 23.65,111.37 U$5.2 | 89.43,99.14 LR1.15 | LR1.14 89.43,99.14 | 89.43,99.14 v89.43,97.49 | v85.93,93.79 v84.23,93.79 | v84.43,86.89 83.3,87.39 82.42,88.27 | LR2.15 LR2.14 88.77,82.75 88.43,82.4 v88.43,81.39 | v89.43,76.49 88.73,76.79 LED5.K | 109.98,97.79 v110.13,97.94 | 30.85,54.52 v32.03,55.69 | v37.23,60.89 40.63,60.89 41.13,61.39 41.13,62.21 C11.2
  Bottom 0.406: v75.44,93.98 76.71,92.71 76.71,87.61 76.93,87.39 81.53,87.39 v81.59,87.33 | v74.17,58.42 v76.71,58.42 | v81.79,71.12 v81.99,73.66 | v81.79,50.8 77.98,50.8 77.98,50.55 v76.09,50.55 | v75.44,44.45 77.98,44.45 79.25,43.18 v81.79,43.18 | v76.71,38.1 v81.79,38.1 | v110.13,97.94 111,99.06 v112.27,99.06 | v122.43,100.33 126.24,100.33 v128.78,97.79 | v135.13,97.79 v140.21,97.79 | v141.48,100.33 149.1,100.33 RS.6 | v29.72,102.87 v34.8,102.87 | v89.43,97.49 89.43,96.69 88.53,95.79 88.53,94.29 88.03,93.79 v85.93,93.79 | v84.23,93.79 84.43,87.69 v84.43,86.89 | v89.43,76.49 89.43,80.39 v88.43,81.39 | v81.69,105.61 80.55,105.61 80.53,105.59 80.53,104.89 80,104.89 v79.25,104.14 | v32.03,55.69 v37.23,60.89
  pour Bottom: 71.63,58.42 71.63,29.21 89.41,29.21 89.41,0 193.55,0 193.55,118.11 23.37,118.11 23.37,74.93 39.88,58.42
HOLE
  cutout Top: 171.96,77.47 174.5,78.74 179.58,78.74 179.58,67.31 171.96,67.31
HORN  (via drill 0.6)
  Top 0.406: U$1.32 107.19,73.66 107.19,77.47 108.46,78.74 v108.46,80.01 | v109.73,87.63 108.46,86.36 v108.46,85.09 | v109.73,90.17 109.73,91.44 112.27,93.98 113.54,93.98 v114.81,95.25 | v114.81,99.06 RC.1
  Bottom 0.406: v109.73,87.63 v109.73,90.17 | v114.81,95.25 v114.81,99.06 | v108.46,85.09 v108.46,80.01
IMU-CS  (via drill 0.6)
  Top 0.406: U$1.A11 117.35,57.15 v118.62,58.42 | v118.62,68.58 118.62,72.39 122.43,76.2 132.59,76.2 133.86,77.47 v154.68,77.47 | v155.45,95.25 152.91,97.79 152.91,100.33 154.18,101.6 IMU.2 | v154.68,84.94 154.68,87.21 v155.3,87.83
  Bottom 0.406: v118.62,58.42 v118.62,68.58 | v155.3,87.83 v155.45,95.25 | v154.68,77.47 v154.68,84.94
LR-EN  (via drill 0.6)
  Top 0.406: v90.68,93.98 93.22,93.98 94.49,95.25 98.3,95.25 98.3,78.62 99.43,77.49 103.4,77.49 U$1.26 | v89.71,95.55 88.14,95.25 87.5,94.61 | 87.5,94.61 86.87,93.98 v86.87,92.71 | v86.87,90.42 86.87,89.46 LR2.4 | LR1.4 87.5,102.23 88.14,101.6 v88.14,97.44 | v86.87,95.25 87.5,94.61
  Bottom 0.406: v90.68,93.98 v89.71,95.55 | v86.87,92.71 v86.87,90.42 | v88.14,97.44 88.14,96.52 v86.87,95.25
MISO  (via drill 0.6)
  Top 0.406: v146.56,95.25 RS.3 147.83,100.33 v151.64,100.33 | v146.56,91.44 v146.56,90.17 | v146.56,76.2 146.56,67.31 145.29,66.04 U$1.MISO_ICSP | IMU.3 156.72,100.33 v154.18,100.33
  Bottom 0.406: v146.56,95.25 v146.56,91.44 | v146.56,90.17 v146.56,76.2 | v154.18,100.33 v151.64,100.33
MOSI  (via drill 0.6)
  Top 0.406: RS.1 144.02,96.52 | 144.02,96.52 v144.02,95.25 | v144.02,91.44 v144.02,90.17 | v144.02,87.93 v144.02,84.79 | v144.02,76.2 145.29,74.93 145.29,68.58 144.02,67.31 131.32,67.31 130.05,66.04 130.05,64.77 131.32,63.5 U$1.MOSI_ICSP | v145.29,96.52 144.02,96.52 | v150.37,96.52 v152.91,96.52
  Bottom 0.406: v144.02,95.25 v144.02,91.44 | v144.02,90.17 v144.02,87.93 | v144.02,84.79 v144.02,76.2 | v150.37,96.52 v145.29,96.52 | v152.91,96.52 155.06,96.52 155.43,96.89 155.43,99.04 IMU.1
N$1  (via drill 0.6)
  Top 0.406: LED1.A v118.62,24.13 | v121.16,17.78 123.7,15.24 R1.2
  Bottom 0.406: v118.62,24.13 118.62,19.05 119.89,17.78 v121.16,17.78
N$2  (via drill 0.6)
  Top 0.406: R2.2 133.86,16.51 v132.59,17.78 | v128.78,25.4 LED2.A
  Bottom 0.406: v132.59,17.78 130.05,17.78 128.78,19.05 v128.78,25.4
N$3  (via drill 0.6)
  Top 0.406: v142.75,13.97 R3.2 | v140.21,25.05 138.27,25.05 137.43,25.89 137.43,26.43 LED3.A
  Bottom 0.406: v140.21,25.05 140.21,19.05 141.48,19.05 142.75,17.78 v142.75,13.97
N$6
  Top 0.406: R19.2 83.06,71.12 LED4.A
N$7
  Top 0.406: U$5.14 21.01,112.01 21.33,111.69 21.33,102.89 20.53,102.09 18.63,102.09 17.63,101.09 17.63,99.38 C32.1
N$8
  Top 0.406: R20.2 LED5.A
N$9
  Top 0.406: U$5.10 U$5.11
N$10
  Top 0.406: U$5.12 17.04,113.28 15.43,114.89 12.87,114.89 | 12.87,114.89 R22.1 | R21.2 7.92,114.38 8.43,114.89 12.87,114.89
N$11
  Top 0.406: U$5.3 28.71,112.01 30.03,110.69 36.64,110.69 C30.1
PANIC
  Top 0.406: U$1.27 100.84,78.74 99.57,80.01 99.57,93.98 100.84,95.25 109.73,95.25 111.15,96.47 111.15,100.33 112.27,101.6 RC.2
REAR-PWM  (via drill 0.6)
  Top 0.406: v79.25,35.56 86.87,35.56 89.41,33.02 114.81,33.02 117.35,30.48 121.16,29.21 123.7,25.4 124.97,25.4 126.24,24.13 131.32,24.13 132.59,25.4 135.13,25.4 136.4,24.13 141.48,24.13 142.75,25.4 149.94,25.4 151.93,27.39 v155.93,27.39 | U$1.8 156.43,86.07 156.43,83.89 156.93,83.39 159.43,83.39 165.93,76.89 168.43,76.89 170.43,74.89 170.43,67.57 171.96,66.04 185.93,66.04 187.2,64.77 187.2,25.4 187.19,25.39 161.93,25.39 159.93,27.39 v158.93,27.39 | U$7.2 74.89,34.92 v75.63,34.39
  Bottom 0.406: v155.93,27.39 v158.93,27.39 | v75.63,34.39 76.43,34.39 77.93,35.89 78.92,35.89 v79.25,35.56
REAR-PWM-FINAL  (via drill 0.6)
  Top 0.406: OP-AMP.1 47.5,33.96 47.5,31.75 50.04,31.75 51.76,33.02 51.76,35.66 50.04,36.83 OP-AMP.4 49.71,43.51 v46.23,46.99 | v39.88,52.07 39.88,53.34 38.61,53.34 v25.91,66.04 | v24.64,68.58 11.94,81.28 11.94,88.9 9.4,91.44 8.13,91.44 BIKEMOTOR.3
  Bottom 0.406: v46.23,46.99 44.96,46.99 v39.88,52.07 | v25.91,66.04 25.91,67.31 v24.64,68.58
REAR-PWMOUT  (via drill 0.6)
  Top 0.406: v53.03,35.51 53.85,35.56 C15.1 v56.39,33.02 | v58.93,33.02 v58.93,30.48 | v58.93,27.94 60.2,27.94 R18.2 | OP-AMP.3 49.97,34.29 v50.74,35.06
  Bottom 0.406: v56.39,33.02 v58.93,33.02 | v58.93,30.48 v58.93,27.94 | v50.74,35.06 52.58,35.06 v53.03,35.51
REAR-PWMR/SERVO2  (via drill 0.6)
  Top 0.406: U$7.7 67.94,35.56 66.55,35.56 66.55,31.75 65.28,30.48 60.2,30.48 58.93,29.21 R18.1 v46.23,43.18 | v20.83,68.58 20.83,69.85 13.21,77.47 SERVO2.1 | v20.83,66.04 22.1,66.04 23.37,64.77 24.64,64.77 36.07,53.34 v36.07,50.8 | v37.34,43.18 v39.88,43.18
  Bottom 0.406: v20.83,68.58 v20.83,66.04 | v36.07,50.8 36.07,43.18 v37.34,43.18 | v39.88,43.18 v46.23,43.18
REAR-TIMER  (via drill 0.6)
  Top 0.406: U$7.6 67.18,36.2 66.55,36.83 61.47,36.83 60.2,38.1 60.2,48.26 v58.93,49.53 | v58.93,55.88 38.61,55.88 13.21,81.28 13.21,88.9 10.67,91.44 10.67,93.98 9.4,95.25 BIKEMOTOR.4
  Bottom 0.406: v58.93,49.53 v58.93,55.88
REAR-TIMER-IN  (via drill 0.6)
  Top 0.406: U$1.11 164.34,85.09 165.61,83.82 188.47,83.82 189.74,82.55 189.74,24.13 188.47,22.86 188.44,22.89 181.93,22.89 179.43,20.39 v159.43,20.39 | U$7.3 74.8,36.83 75.44,36.83 76.71,35.56 76.71,31.75 77.98,30.48 113.54,30.48 114.81,29.21 114.81,25.4 118.62,21.59 146.56,21.59 147.83,22.86 150.4,22.86 152.43,24.89 v154.43,24.89
  Bottom 0.406: v154.43,24.89 157.93,24.89 158.93,23.89 158.93,20.89 v159.43,20.39
REG5V  (via drill 0.6, 0.8)
  Top 0.254: C16.1 64.01,41.91 v62.74,40.64 | v58.93,41.91 59.56,41.27 59.56,36.2 v64.01,31.75
  Top 0.406: U$7.8 68.58,32.51 65.28,29.21 | 65.28,29.21 62.74,29.21 62.74,15.24 61.47,13.97 56.41,13.97 VREGULATOR.2 | v64.01,27.94 65.28,29.21 | 66.67,52.2 v66.55,52.07 | v62.74,48.58 C19.1 64.01,46.99 | 64.01,46.99 C16.1 | 64.26,46.74 64.01,46.99 | U$2.8 65.28,39.88 | 65.28,39.88 64.52,39.88 | OP-AMP.5 47.83,38.43 v48.77,39.37 | v51.31,40.64 C20.1 56.15,41.67 | 56.15,41.67 56.39,41.91 v58.93,41.91 | v61.47,40.79 v62.74,40.64 | v65.28,40.64 65.28,39.88 | U$5.16 16.81,107.83 C31.1 17.53,105.19 18.53,106.39 20.63,106.39 20.63,103.49 20.33,103.19 18.83,103.19 18.53,102.89 17.63,102.89 16.23,101.49 16.23,79.49 38.73,56.99 v53.43,56.99 | v53.43,44.59 53.43,44.39 56.15,41.67
  Top 0.813: v53.85,12.7 55.4,14.25 VREGULATOR.2 60.93,19.05 C14.1 | v50.04,12.7 33.49,12.7 5VOUTPUT.2
  Bottom 0.406: v64.01,31.75 v64.01,27.94 | v66.55,52.07 64.01,52.07 62.74,50.8 v62.74,48.58 | v48.77,39.37 50.04,39.37 v51.31,40.64 | v58.93,41.91 60.2,41.91 v61.47,40.79 | v62.74,40.64 v65.28,40.64 | v53.43,56.99 v53.43,44.59
  Bottom 0.813: v53.85,12.7 v50.04,12.7
REV  (via drill 0.6)
  Top 0.406: U$1.33 100.84,72.39 98.3,72.39 98.3,74.93 97.03,76.2 v97.03,91.44 | v100.84,92.71 107.19,92.71 v107.19,93.98 | v111,93.98 112.27,95.25 v113.54,95.25 | v113.54,97.79 117.35,97.79 RC.3
  Bottom 0.406: v97.03,91.44 98.3,91.44 99.57,92.71 v100.84,92.71 | v107.19,93.98 v111,93.98 | v113.54,95.25 v113.54,97.79
RS-CS  (via drill 0.6)
  Top 0.406: U$1.52 v107.19,43.18 | v111,43.18 111,57.15 112.27,58.42 116.08,58.42 v117.35,59.69 | v117.35,68.58 117.35,72.39 122.43,77.47 v131.32,77.47 | v132.59,85.09 v132.59,91.44 | v132.59,95.25 v135.13,95.25 | v138.94,95.25 138.94,99.06 141.48,101.6 RS.2
  Bottom 0.406: v107.19,43.18 v111,43.18 | v117.35,59.69 v117.35,68.58 | v131.32,77.47 132.59,78.74 v132.59,85.09 | v132.59,91.44 v132.59,95.25 | v135.13,95.25 v138.94,95.25
RX0
  Top 0.406: SPINS.1 136.65,89.15 135.13,87.63 U$1.RX0
RX2
  Top 0.406: U$1.RX2 122.43,87.63 126.24,91.44 126.24,101.6 127.51,102.87 130.05,102.87 131.32,101.6 131.32,100.97 SPINS.3
RX3  (via drill 0.6)
  Top 0.406: U$1.RX3 127.51,90.17 128.78,91.44 128.78,92.71 130.05,93.98 v135.13,93.98 | v138.94,93.98 168.15,93.98 169.42,95.25 GPS.2
  Bottom 0.406: v135.13,93.98 v138.94,93.98
SAIL-IN
  Top 0.813: 52.54,8 53.43,8.89 56.43,8.89 58.43,10.89 60.81,10.89 PWR-JUMPER.3
SCK  (via drill 0.6)
  Top 0.406: U$1.SCK_ICSP 146.56,63.5 147.83,64.77 147.83,74.93 v149.1,76.2 | v149.1,95.25 149.1,97.79 | 149.1,97.79 RS.5 | IMU.5 159.26,97.79 v154.18,97.79 | v151.64,97.79 149.1,97.79
  Bottom 0.406: v149.1,76.2 v149.1,95.25 | v154.18,97.79 v151.64,97.79
TX0
  Top 0.406: U$1.TX0 137.67,99.06 138.94,100.33 138.94,101.6 137.67,102.87 135.13,102.87 133.86,101.6 133.86,100.97 SPINS.2
TX2
  Top 0.406: SPINS.4 129.03,100.58 127.51,99.06 127.51,91.44 124.97,88.9 U$1.TX2
TX3  (via drill 0.6)
  Top 0.406: U$1.TX3 130.05,91.44 131.32,92.71 v135.13,92.71 | v138.94,92.71 v161.8,92.71 | v169.42,93.98 171.96,96.52 GPS.3
  Bottom 0.406: v135.13,92.71 v138.94,92.71 | v161.8,92.71 168.15,92.71 v169.42,93.98
VIN
  Top 0.813: VIN-JUMPER.2 90.68,3.81 91.95,2.54 93.47,2.49 96.01,5.03 152.91,5.08 155.93,6.65 155.93,11 152.37,14.51 152.37,21.33 154.43,23.39 155.93,23.39 157.43,24.89 157.43,33.89 155.43,35.89 153.43,35.89 153.43,37.58 U$1.VIN